# EAGLE design Register (EAGLE 9.6.2)
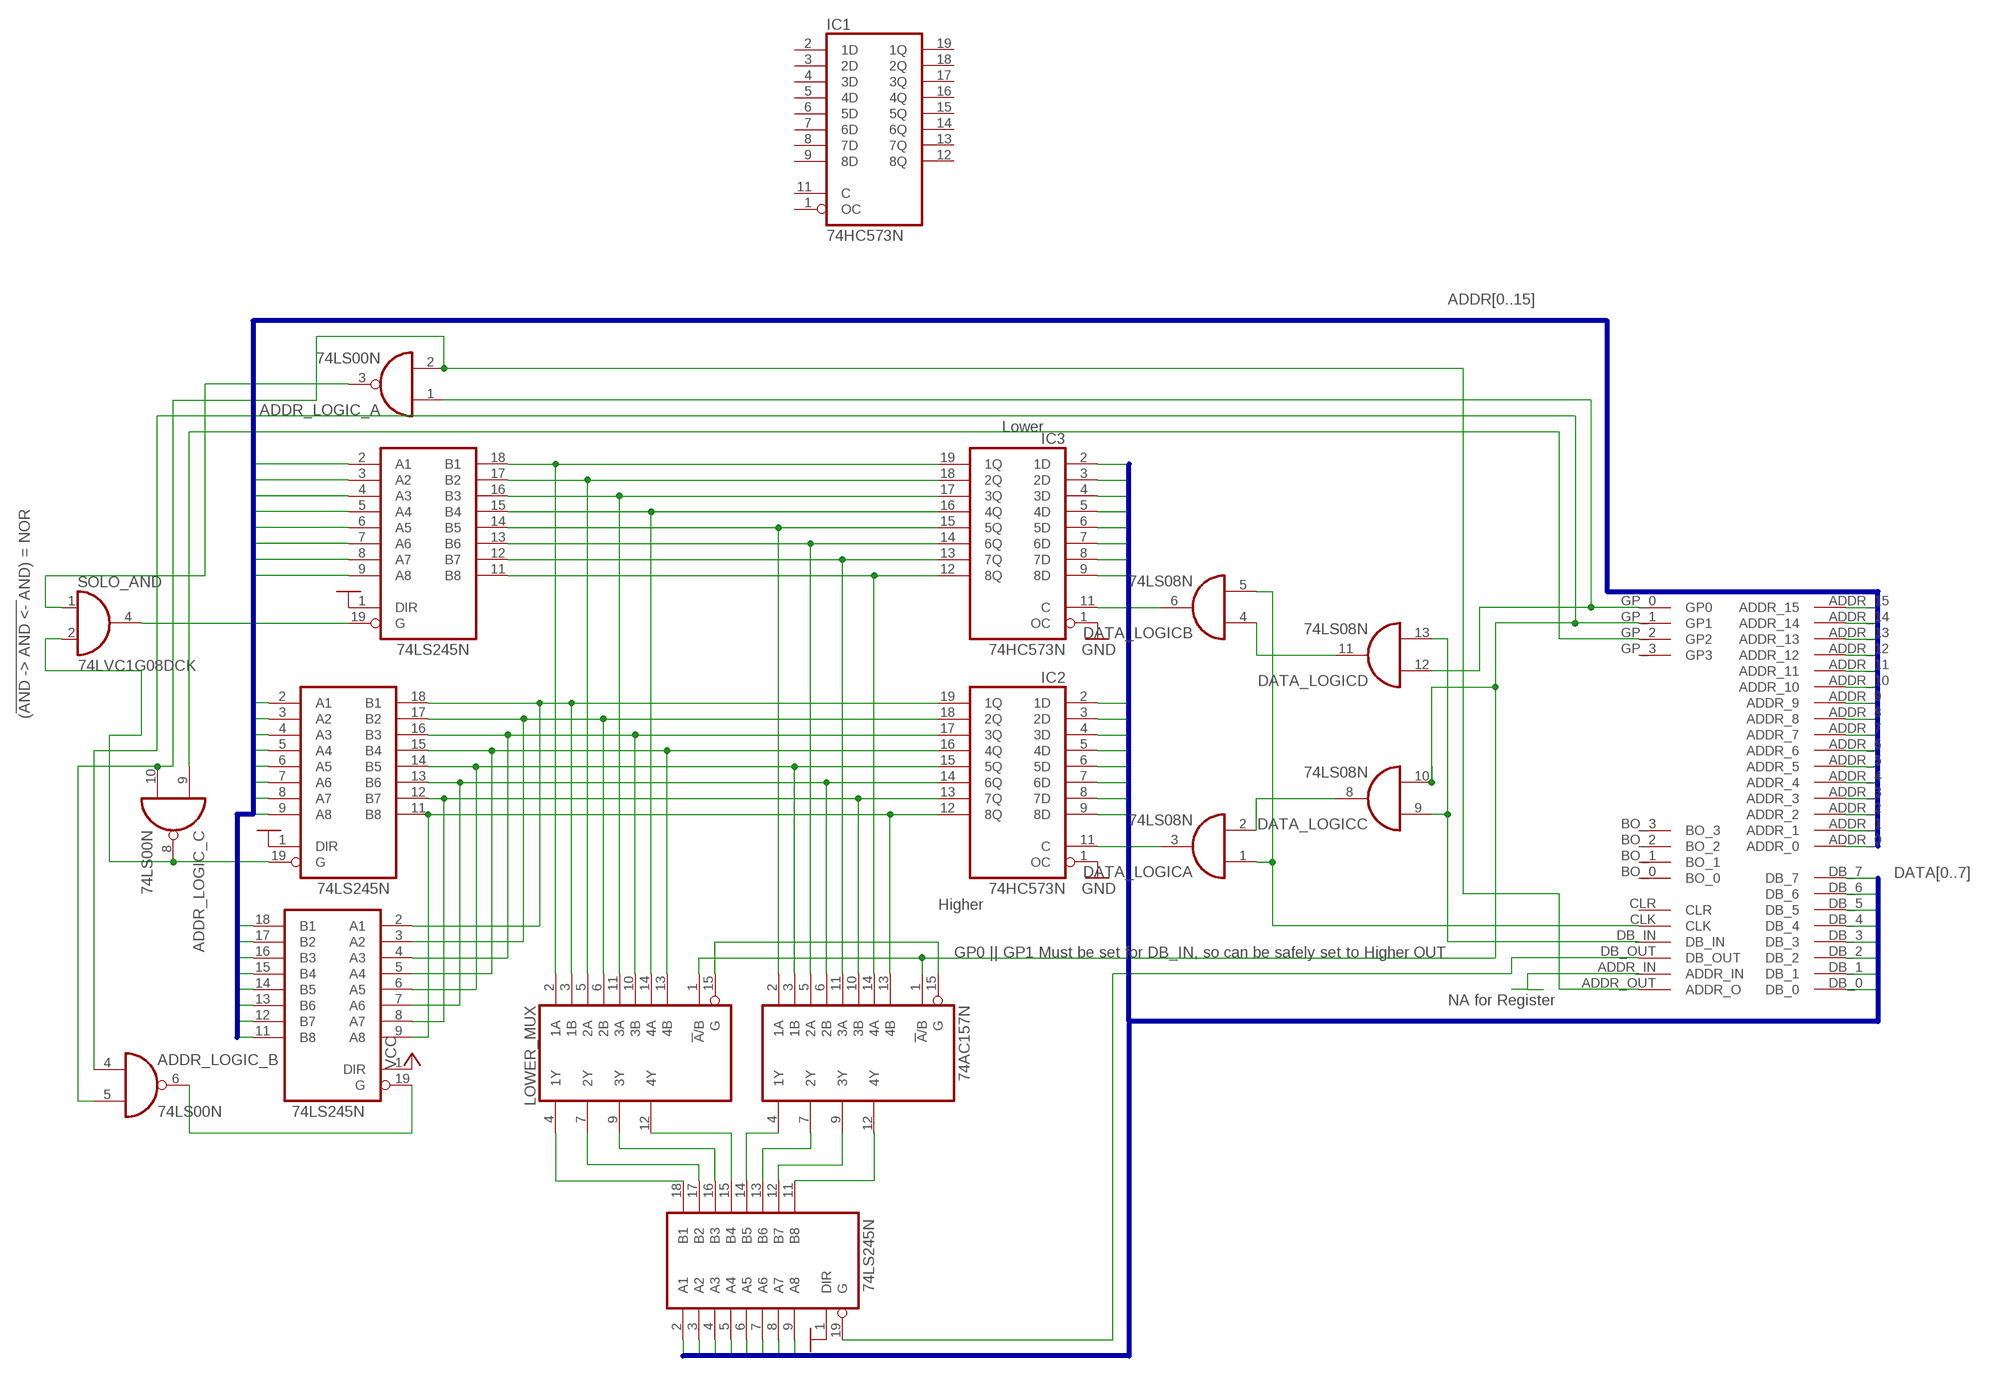
[diagram p0: schematic, sheet 1]

## Parts
ADDR_HIGHER_BUFFER  74LS245N  [DIL20]
ADDR_HIGHER_TO_LOWER  74LS245N  [DIL20]
ADDR_LOGIC_  74LS00N  [DIL14]
ADDR_LOWER_BUFFER  74LS245N  [DIL20]
DATA_LOGIC  74LS08N  [DIL14]
DATA_OUTPUT_BUFFER  74LS245N  [DIL20]
HIGHER_MUX  74AC157N  [DIL16]
IC1  74HC573N  [DIL20]
IC2  74HC573N  [DIL20]
IC3  74HC573N  [DIL20]
LOWER_MUX  74AC157N  [DIL16]
SOLO_AND  74LVC1G08DCK  [SC70-5]
U$1  BACKPLATE_INTERFACEEDGE_FINGER  [BACK_INTERFACE-FOOT]

## Nets
ADDR0: ADDR_HIGHER_TO_LOWER.18(B1) ADDR_LOWER_BUFFER.2(A1) U$1.ADDR_0
ADDR1: ADDR_HIGHER_TO_LOWER.17(B2) ADDR_LOWER_BUFFER.3(A2) U$1.ADDR_1
ADDR2: ADDR_HIGHER_TO_LOWER.16(B3) ADDR_LOWER_BUFFER.4(A3) U$1.ADDR_2
ADDR3: ADDR_HIGHER_TO_LOWER.15(B4) ADDR_LOWER_BUFFER.5(A4) U$1.ADDR_3
ADDR4: ADDR_HIGHER_TO_LOWER.14(B5) ADDR_LOWER_BUFFER.6(A5) U$1.ADDR_4
ADDR5: ADDR_HIGHER_TO_LOWER.13(B6) ADDR_LOWER_BUFFER.7(A6) U$1.ADDR_5
ADDR6: ADDR_HIGHER_TO_LOWER.12(B7) ADDR_LOWER_BUFFER.8(A7) U$1.ADDR_6
ADDR7: ADDR_HIGHER_TO_LOWER.11(B8) ADDR_LOWER_BUFFER.9(A8) U$1.ADDR_7
ADDR8: ADDR_HIGHER_BUFFER.2(A1) U$1.ADDR_8
ADDR9: ADDR_HIGHER_BUFFER.3(A2) U$1.ADDR_9
ADDR10: ADDR_HIGHER_BUFFER.4(A3) U$1.ADDR_10
ADDR11: ADDR_HIGHER_BUFFER.5(A4) U$1.ADDR_11
ADDR12: ADDR_HIGHER_BUFFER.6(A5) U$1.ADDR_12
ADDR13: ADDR_HIGHER_BUFFER.7(A6) U$1.ADDR_13
ADDR14: ADDR_HIGHER_BUFFER.8(A7) U$1.ADDR_14
ADDR15: ADDR_HIGHER_BUFFER.9(A8) U$1.ADDR_15
CLK: DATA_LOGIC.1(A:I0) DATA_LOGIC.5(B:I1) U$1.CLK
CTRL_ADDR_OUT: ADDR_LOGIC_.2(A:I1) ADDR_LOGIC_.5(B:I1) ADDR_LOGIC_.10(C:I1) U$1.ADDR_OUT(ADDR_O)
CTRL_DB_IN: DATA_LOGIC.9(C:I0) DATA_LOGIC.13(D:I1) U$1.DB_IN
CTRL_DB_OUT: DATA_OUTPUT_BUFFER.19(G) U$1.DB_OUT
DATA0: DATA_OUTPUT_BUFFER.2(A1) IC2.2(1D) IC3.2(1D) U$1.DB_0
DATA1: DATA_OUTPUT_BUFFER.3(A2) IC2.3(2D) IC3.3(2D) U$1.DB_1
DATA2: DATA_OUTPUT_BUFFER.4(A3) IC2.4(3D) IC3.4(3D) U$1.DB_2
DATA3: DATA_OUTPUT_BUFFER.5(A4) IC2.5(4D) IC3.5(4D) U$1.DB_3
DATA4: DATA_OUTPUT_BUFFER.6(A5) IC2.6(5D) IC3.6(5D) U$1.DB_4
DATA5: DATA_OUTPUT_BUFFER.7(A6) IC2.7(6D) IC3.7(6D) U$1.DB_5
DATA6: DATA_OUTPUT_BUFFER.8(A7) IC2.8(7D) IC3.8(7D) U$1.DB_6
DATA7: DATA_OUTPUT_BUFFER.9(A8) IC2.9(8D) IC3.9(8D) U$1.DB_7
DATA_0: ADDR_LOWER_BUFFER.18(B1) IC3.19(1Q) LOWER_MUX.2(1A)
DATA_1: ADDR_LOWER_BUFFER.17(B2) IC3.18(2Q) LOWER_MUX.5(2A)
DATA_2: ADDR_LOWER_BUFFER.16(B3) IC3.17(3Q) LOWER_MUX.11(3A)
DATA_3: ADDR_LOWER_BUFFER.15(B4) IC3.16(4Q) LOWER_MUX.14(4A)
DATA_4: ADDR_LOWER_BUFFER.14(B5) HIGHER_MUX.2(1A) IC3.15(5Q)
DATA_5: ADDR_LOWER_BUFFER.13(B6) HIGHER_MUX.5(2A) IC3.14(6Q)
DATA_6: ADDR_LOWER_BUFFER.12(B7) HIGHER_MUX.11(3A) IC3.13(7Q)
DATA_7: ADDR_LOWER_BUFFER.11(B8) HIGHER_MUX.14(4A) IC3.12(8Q)
DATA_8: ADDR_HIGHER_BUFFER.18(B1) ADDR_HIGHER_TO_LOWER.2(A1) IC2.19(1Q) LOWER_MUX.3(1B)
DATA_9: ADDR_HIGHER_BUFFER.17(B2) ADDR_HIGHER_TO_LOWER.3(A2) IC2.18(2Q) LOWER_MUX.6(2B)
DATA_10: ADDR_HIGHER_BUFFER.16(B3) ADDR_HIGHER_TO_LOWER.4(A3) IC2.17(3Q) LOWER_MUX.10(3B)
DATA_11: ADDR_HIGHER_BUFFER.15(B4) ADDR_HIGHER_TO_LOWER.5(A4) IC2.16(4Q) LOWER_MUX.13(4B)
DATA_12: ADDR_HIGHER_BUFFER.14(B5) ADDR_HIGHER_TO_LOWER.6(A5) HIGHER_MUX.3(1B) IC2.15(5Q)
DATA_13: ADDR_HIGHER_BUFFER.13(B6) ADDR_HIGHER_TO_LOWER.7(A6) HIGHER_MUX.6(2B) IC2.14(6Q)
DATA_14: ADDR_HIGHER_BUFFER.12(B7) ADDR_HIGHER_TO_LOWER.8(A7) HIGHER_MUX.10(3B) IC2.13(7Q)
DATA_15: ADDR_HIGHER_BUFFER.11(B8) ADDR_HIGHER_TO_LOWER.9(A8) HIGHER_MUX.13(4B) IC2.12(8Q)
GND: ADDR_HIGHER_BUFFER.1(DIR) ADDR_LOWER_BUFFER.1(DIR) DATA_OUTPUT_BUFFER.1(DIR) IC2.1(OC) IC3.1(OC)
GP_0: ADDR_LOGIC_.1(A:I0) DATA_LOGIC.12(D:I0) U$1.GP_0(GP0)
GP_1: ADDR_LOGIC_.4(B:I0) DATA_LOGIC.10(C:I1) HIGHER_MUX.1(!A!/B) LOWER_MUX.1(!A!/B) U$1.GP_1(GP1)
GP_2: ADDR_LOGIC_.9(C:I0) U$1.GP_2(GP2)
N$2: DATA_OUTPUT_BUFFER.18(B1) LOWER_MUX.4(1Y)
N$3: DATA_OUTPUT_BUFFER.17(B2) LOWER_MUX.7(2Y)
N$4: DATA_LOGIC.6(B:O) IC3.11(C)
N$5: DATA_LOGIC.3(A:O) IC2.11(C)
N$6: DATA_LOGIC.4(B:I0) DATA_LOGIC.11(D:O)
N$7: DATA_LOGIC.2(A:I1) DATA_LOGIC.8(C:O)
N$24: DATA_OUTPUT_BUFFER.16(B3) LOWER_MUX.9(3Y)
N$26: DATA_OUTPUT_BUFFER.15(B4) LOWER_MUX.12(4Y)
N$28: DATA_OUTPUT_BUFFER.14(B5) HIGHER_MUX.4(1Y)
N$29: U$1.ADDR_IN
N$30: DATA_OUTPUT_BUFFER.13(B6) HIGHER_MUX.7(2Y)
N$31: DATA_OUTPUT_BUFFER.12(B7) HIGHER_MUX.9(3Y)
N$32: DATA_OUTPUT_BUFFER.11(B8) HIGHER_MUX.12(4Y)
N$34: ADDR_HIGHER_TO_LOWER.19(G) ADDR_LOGIC_.6(B:O)
N$35: HIGHER_MUX.15(G) LOWER_MUX.15(G)
N$38: ADDR_HIGHER_BUFFER.19(G) ADDR_LOGIC_.8(C:O) SOLO_AND.2(I1)
N$39: ADDR_LOGIC_.3(A:O) SOLO_AND.1(I0)
N$41: ADDR_LOWER_BUFFER.19(G) SOLO_AND.4(O)
VCC: ADDR_HIGHER_TO_LOWER.1(DIR)
Unconnected: ADDR_LOGIC_.11(D:O) ADDR_LOGIC_.12(D:I0) ADDR_LOGIC_.13(D:I1) IC1.1(OC) IC1.2(1D) IC1.3(2D) IC1.4(3D) IC1.5(4D) IC1.6(5D) IC1.7(6D) IC1.8(7D) IC1.9(8D) IC1.11(C) IC1.12(8Q) IC1.13(7Q) IC1.14(6Q) IC1.15(5Q) IC1.16(4Q) IC1.17(3Q) IC1.18(2Q) IC1.19(1Q) U$1.BO_0 U$1.BO_1 U$1.BO_2 U$1.BO_3 U$1.CLR U$1.GP_3(GP3) U$1.NC_0 U$1.NC_1 U$1.NC_2 U$1.NC_3 U$1.NC_4 U$1.NC_5 U$1.NC_6 U$1.NC_7 U$1.NC_8 U$1.NC_9 U$1.NC_10 U$1.NC_11 U$1.NC_12 U$1.NC_13 U$1.NC_14 U$1.NC_15 U$1.NC_16 U$1.NC_17 U$1.NC_18 U$1.NC_19 U$1.NC_20 U$1.NC_21

## Buses
DATA[0..7]
ADDR[0..15]

## Notes on the sheet
- Lower
- (!AND -> AND <- !AND) = NOR
- Higher
- GP0 || GP1 Must be set for DB_IN, so can be safely set to Higher OUT
- NA for Register

## Power pins joined to a net without a drawn wire
GND: ADDR_HIGHER_BUFFER.10(GND) ADDR_HIGHER_TO_LOWER.10(GND) ADDR_LOGIC_.7(P:GND) ADDR_LOWER_BUFFER.10(GND) DATA_LOGIC.7(P:GND) DATA_OUTPUT_BUFFER.10(GND) HIGHER_MUX.8(GND) IC1.10(GND) IC2.10(GND) IC3.10(GND) LOWER_MUX.8(GND) SOLO_AND.3(GND) U$1.GND_0(GND) U$1.GND_1(GND)
VCC: ADDR_HIGHER_BUFFER.20(VCC) ADDR_HIGHER_TO_LOWER.20(VCC) ADDR_LOGIC_.14(P:VCC) ADDR_LOWER_BUFFER.20(VCC) DATA_LOGIC.14(P:VCC) DATA_OUTPUT_BUFFER.20(VCC) HIGHER_MUX.16(VCC) IC1.20(VCC) IC2.20(VCC) IC3.20(VCC) LOWER_MUX.16(VCC) SOLO_AND.5(VCC) U$1.VCC_0(VCC) U$1.VCC_1(VCC)

## Library data of the parts
ADDR_HIGHER_BUFFER ADDR_HIGHER_TO_LOWER ADDR_LOWER_BUFFER DATA_OUTPUT_BUFFER = 74xx-eu:74*245: Octal BUS TRANSCEIVER, 3-state
ADDR_LOGIC_ = 74xx-eu:74*00: Quad 2-input NAND gate
DATA_LOGIC = 74xx-eu:74*08: Quad 2-input AND gate
HIGHER_MUX LOWER_MUX = 74xx-eu:74*157: Quadruple 2-line to 1-line data SELECTOR/MULTIPLEXER
IC1-IC3 = 74xx-eu:74*573: 8-bit D latch BUS DRIVER
SOLO_AND = 74xx-little-de:74*1G08: 2-input AND gate
U$1 = Computer:BACKPLATE_INTERFACE

## Board
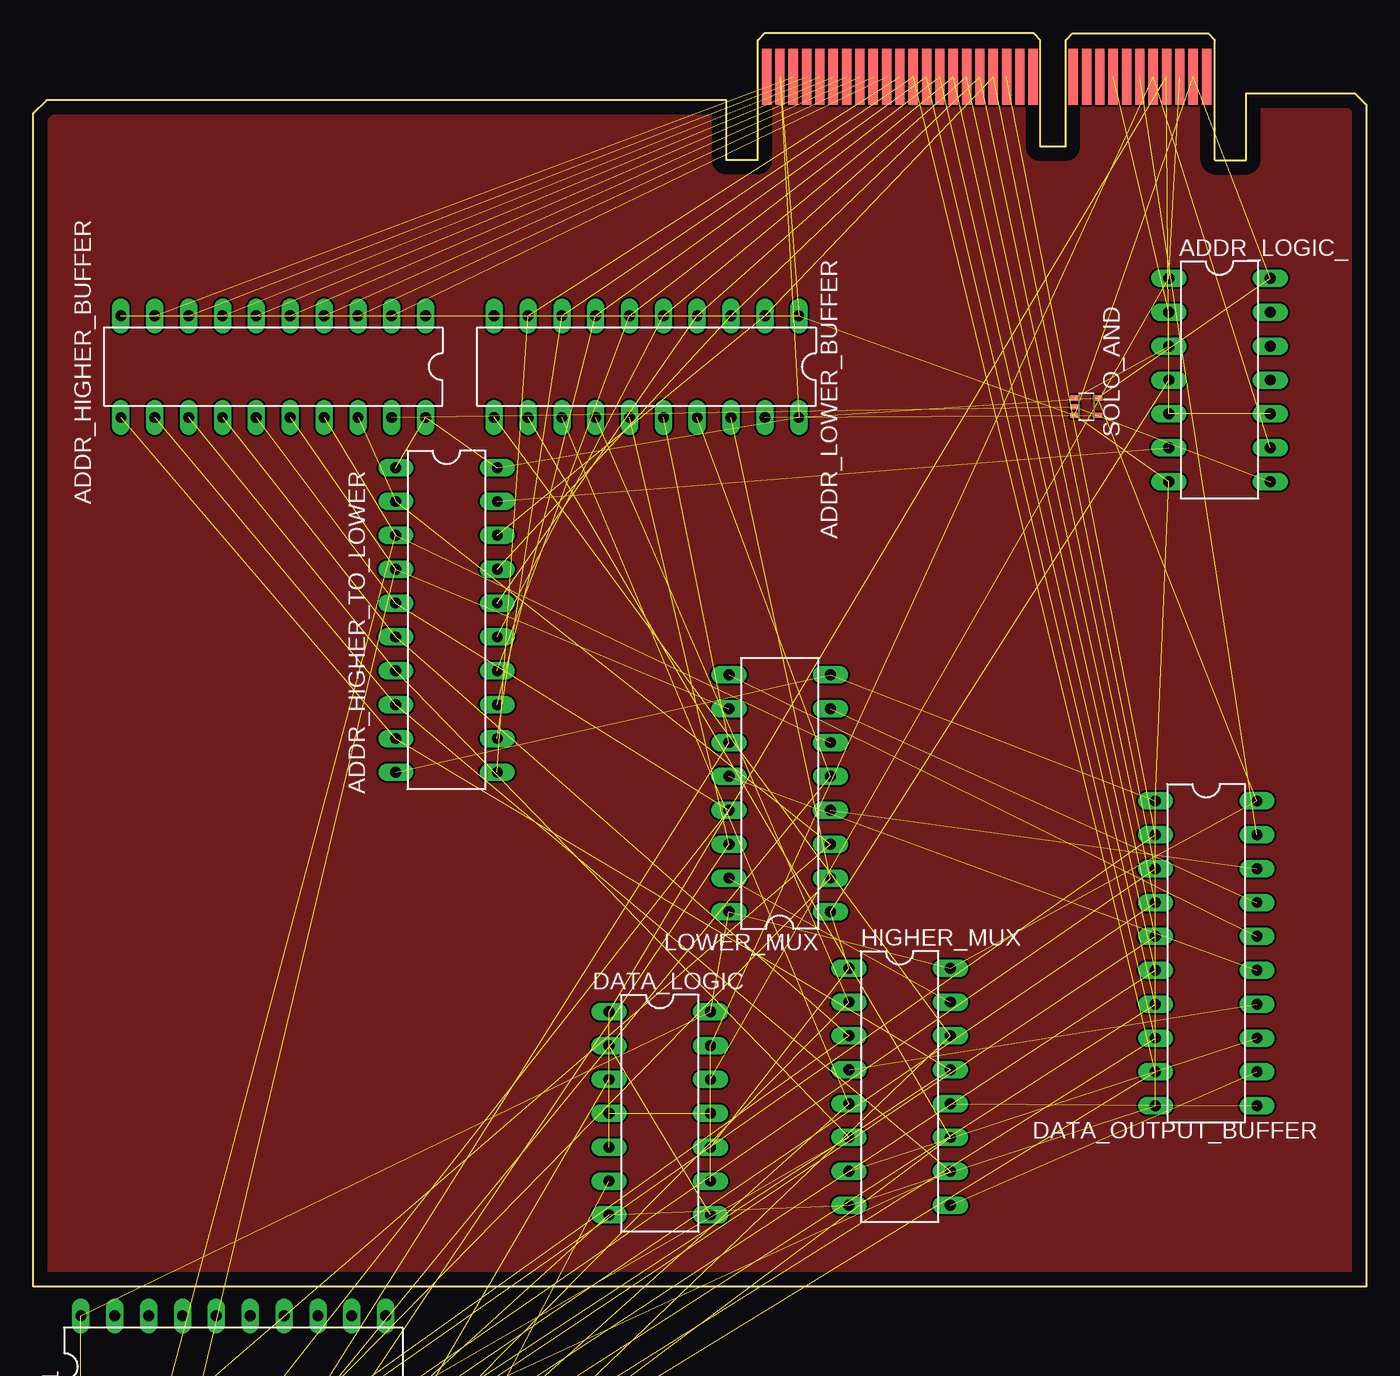
[diagram p1: board, top side]
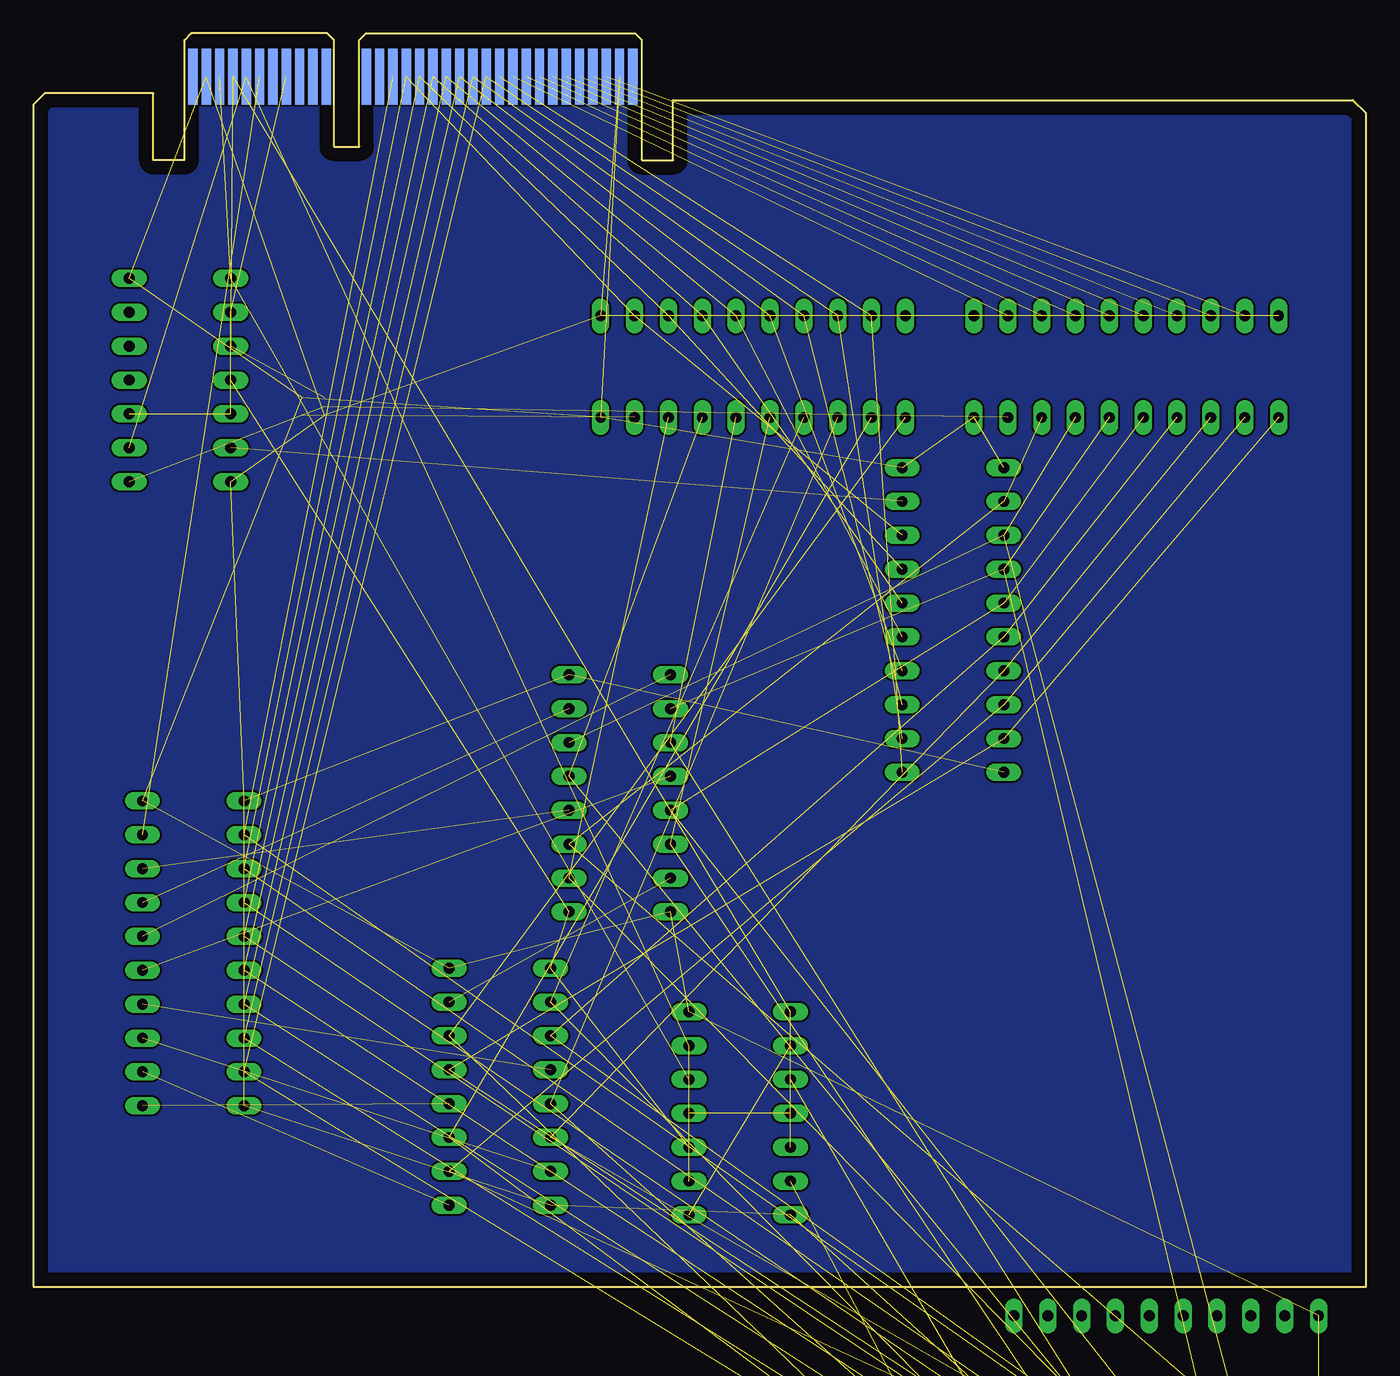
[diagram p2: board, bottom side, seen from below]

Size 100 x 94 mm. Coordinates in mm from the lower left corner, seen from the top.
Outline: 0,0 0,88 1,89 52,89 52,84.5 54.35,84.5 54.35,93.5 54.85,94 75.05,94 75.55,93.5 75.55,85.5 77.45,85.5 77.45,93.5 77.95,94 88.15,94 88.65,93.5 88.65,84.5 91,84.5 91,89.5 99.15,89.5 100,88.65 100,0 0,0
Copper layers (1+2*15+16): Top 0.035mm / dielectric 1.5mm / Route2 0.035mm / dielectric 0.15mm / Route15 0.035mm / dielectric 0.2mm / Bottom 0.035mm
Design rules "default *": minimum track width 16mil, minimum drill 0.35mm, track to track 6mil, track to pad 6mil, pad to pad 6mil, via to via 6mil, smd to smd 6mil, copper to edge 40mil, drill to drill 6mil, minimum pad ring 10mil, minimum via ring 8mil, stop-mask expansion 4mil, vias tented up to drill 0mil, thermal gap 10mil

### Footprints (pad centres in the part's own frame; a part is rotated, then mirrored left to right if it is on the bottom)
DIL20 = drill 0.813 long: 1 -11.43,-3.81; 2 -8.89,-3.81; 3 -6.35,-3.81; 4 -3.81,-3.81; 5 -1.27,-3.81; 6 1.27,-3.81; 7 3.81,-3.81; 8 6.35,-3.81; 9 8.89,-3.81; 10 11.43,-3.81; 11 11.43,3.81; 12 8.89,3.81; 13 6.35,3.81; 14 3.81,3.81; 15 1.27,3.81; 16 -1.27,3.81; 17 -3.81,3.81; 18 -6.35,3.81; 19 -8.89,3.81; 20 -11.43,3.81
DIL14 = drill 0.813 long: 1 -7.62,-3.81; 2 -5.08,-3.81; 3 -2.54,-3.81; 4 0,-3.81; 5 2.54,-3.81; 6 5.08,-3.81; 7 7.62,-3.81; 8 7.62,3.81; 9 5.08,3.81; 10 2.54,3.81; 11 0,3.81; 12 -2.54,3.81; 13 -5.08,3.81; 14 -7.62,3.81
DIL16 = drill 0.813 long: 1 -8.89,-3.81; 2 -6.35,-3.81; 3 -3.81,-3.81; 4 -1.27,-3.81; 5 1.27,-3.81; 6 3.81,-3.81; 7 6.35,-3.81; 8 8.89,-3.81; 9 8.89,3.81; 10 6.35,3.81; 11 3.81,3.81; 12 1.27,3.81; 13 -1.27,3.81; 14 -3.81,3.81; 15 -6.35,3.81; 16 -8.89,3.81
SC70-5 = smd 0.4 x 0.7: 1 -0.65,-0.85; 2 0,-0.85; 3 0.65,-0.85; 4 0.65,0.85; 5 -0.65,0.85
BACK_INTERFACE-FOOT = smd 0.7 x 4.2: ADDR_0 17.02,0; ADDR_1 16.02,0; ADDR_2 15.02,0; ADDR_3 14.02,0; ADDR_4 13.02,0; ADDR_5 12.02,0; ADDR_6 11.02,0; ADDR_7 10.02,0; ADDR_8 9.02,0; ADDR_9 8.02,0; ADDR_10 7.02,0; ADDR_11 6.02,0; ADDR_12 5.02,0; ADDR_13 4.02,0; ADDR_14 3.02,0; ADDR_15 2.02,0; ADDR_IN 27.02,0; ADDR_OUT 26.02,0; CLK 30.02,0; CLR 31.02,0; DB_IN 29.02,0; DB_OUT 28.02,0; GND_0 32.02,0; GND_1 1.02,0; NC_0 33.02,0; NC_1 25.02,0; NC_2 24.02,0; NC_3 23.02,0; NC_4 20.02,0; NC_5 19.02,0; NC_6 18.02,0; NC_7 0.02,0 | smd 0.7 x 4.2 bottom: BO_0 27.02,0; BO_1 26.02,0; BO_2 25.02,0; BO_3 24.02,0; DB_0 18.02,0; DB_1 17.02,0; DB_2 16.02,0; DB_3 15.02,0; DB_4 14.02,0; DB_5 13.02,0; DB_6 12.02,0; DB_7 11.02,0; GP_0 31.02,0; GP_1 30.02,0; GP_2 29.02,0; GP_3 28.02,0; NC_8 33.02,0; NC_9 23.02,0; NC_10 20.02,0; NC_11 19.02,0; NC_12 10.02,0; NC_13 9.02,0; NC_14 8.02,0; NC_15 7.02,0; NC_16 6.02,0; NC_17 5.02,0; NC_18 4.02,0; NC_19 3.02,0; NC_20 2.02,0; NC_21 0.02,0; VCC_0 32.02,0; VCC_1 1.02,0

### Placement (x,y rotation side)
ADDR_HIGHER_BUFFER  18,69 180 top
ADDR_HIGHER_TO_LOWER  31,50 270 top
ADDR_LOGIC_  89,68 270 top
ADDR_LOWER_BUFFER  46,69 180 top
DATA_LOGIC  47,13 270 top
DATA_OUTPUT_BUFFER  88,25 270 top
HIGHER_MUX  65,15 270 top
IC1  15,-6 0 top
IC2  15,-17 0 top  (outside the outline)
IC3  15,-28 0 top  (outside the outline)
LOWER_MUX  56,37 90 top
SOLO_AND  79,66 270 top
U$1  55,90.75 0 top

### Tracks (layer width: path | path; a pad name or v marks a point on that pad's centre or on a via)
ADDR0  (2 unrouted)
ADDR1  (2 unrouted)
ADDR2  (2 unrouted)
ADDR3  (2 unrouted)
ADDR4  (2 unrouted)
ADDR5  (2 unrouted)
ADDR6  (2 unrouted)
ADDR7  (2 unrouted)
ADDR8  (1 unrouted)
ADDR9  (1 unrouted)
ADDR10  (1 unrouted)
ADDR11  (1 unrouted)
ADDR12  (1 unrouted)
ADDR13  (1 unrouted)
ADDR14  (1 unrouted)
ADDR15  (1 unrouted)
CLK  (2 unrouted)
CTRL_ADDR_OUT  (3 unrouted)
CTRL_DB_IN  (2 unrouted)
CTRL_DB_OUT  (1 unrouted)
DATA0  (3 unrouted)
DATA1  (3 unrouted)
DATA2  (3 unrouted)
DATA3  (3 unrouted)
DATA4  (3 unrouted)
DATA5  (3 unrouted)
DATA6  (3 unrouted)
DATA7  (3 unrouted)
DATA_0  (2 unrouted)
DATA_1  (2 unrouted)
DATA_2  (2 unrouted)
DATA_3  (2 unrouted)
DATA_4  (2 unrouted)
DATA_5  (2 unrouted)
DATA_6  (2 unrouted)
DATA_7  (2 unrouted)
DATA_8  (3 unrouted)
DATA_9  (3 unrouted)
DATA_10  (3 unrouted)
DATA_11  (3 unrouted)
DATA_12  (3 unrouted)
DATA_13  (3 unrouted)
DATA_14  (3 unrouted)
DATA_15  (3 unrouted)
GND  (18 unrouted)
GND1
  pour Top: 0,88 1,89 52,89 52,84.5 54.35,84.5 54.35,93.5 54.85,94 75.05,94 75.55,93.5 75.55,85.5 77.45,85.5 77.45,93.5 77.95,94 88.15,94 88.65,93.5 88.65,84.5 91,84.5 91,89.5 99.15,89.5 100,88.65 100,0 0,0
GP_0  (2 unrouted)
GP_1  (4 unrouted)
GP_2  (1 unrouted)
N$2  (1 unrouted)
N$3  (1 unrouted)
N$4  (1 unrouted)
N$5  (1 unrouted)
N$6  (1 unrouted)
N$7  (1 unrouted)
N$24  (1 unrouted)
N$26  (1 unrouted)
N$28  (1 unrouted)
N$30  (1 unrouted)
N$31  (1 unrouted)
N$32  (1 unrouted)
N$34  (1 unrouted)
N$35  (1 unrouted)
N$38  (2 unrouted)
N$39  (1 unrouted)
N$41  (1 unrouted)
VCC  (14 unrouted)
VCC1
  pour Bottom: 0,88 1,89 52,89 52,84.5 54.35,84.5 54.35,93.5 54.85,94 75.05,94 75.55,93.5 75.55,85.5 77.45,85.5 77.45,93.5 77.95,94 88.15,94 88.65,93.5 88.65,84.5 91,84.5 91,89.5 99.15,89.5 100,88.65 100,0 0,0